# Altium project Service_board.PrjPcb (part 1 of 9)
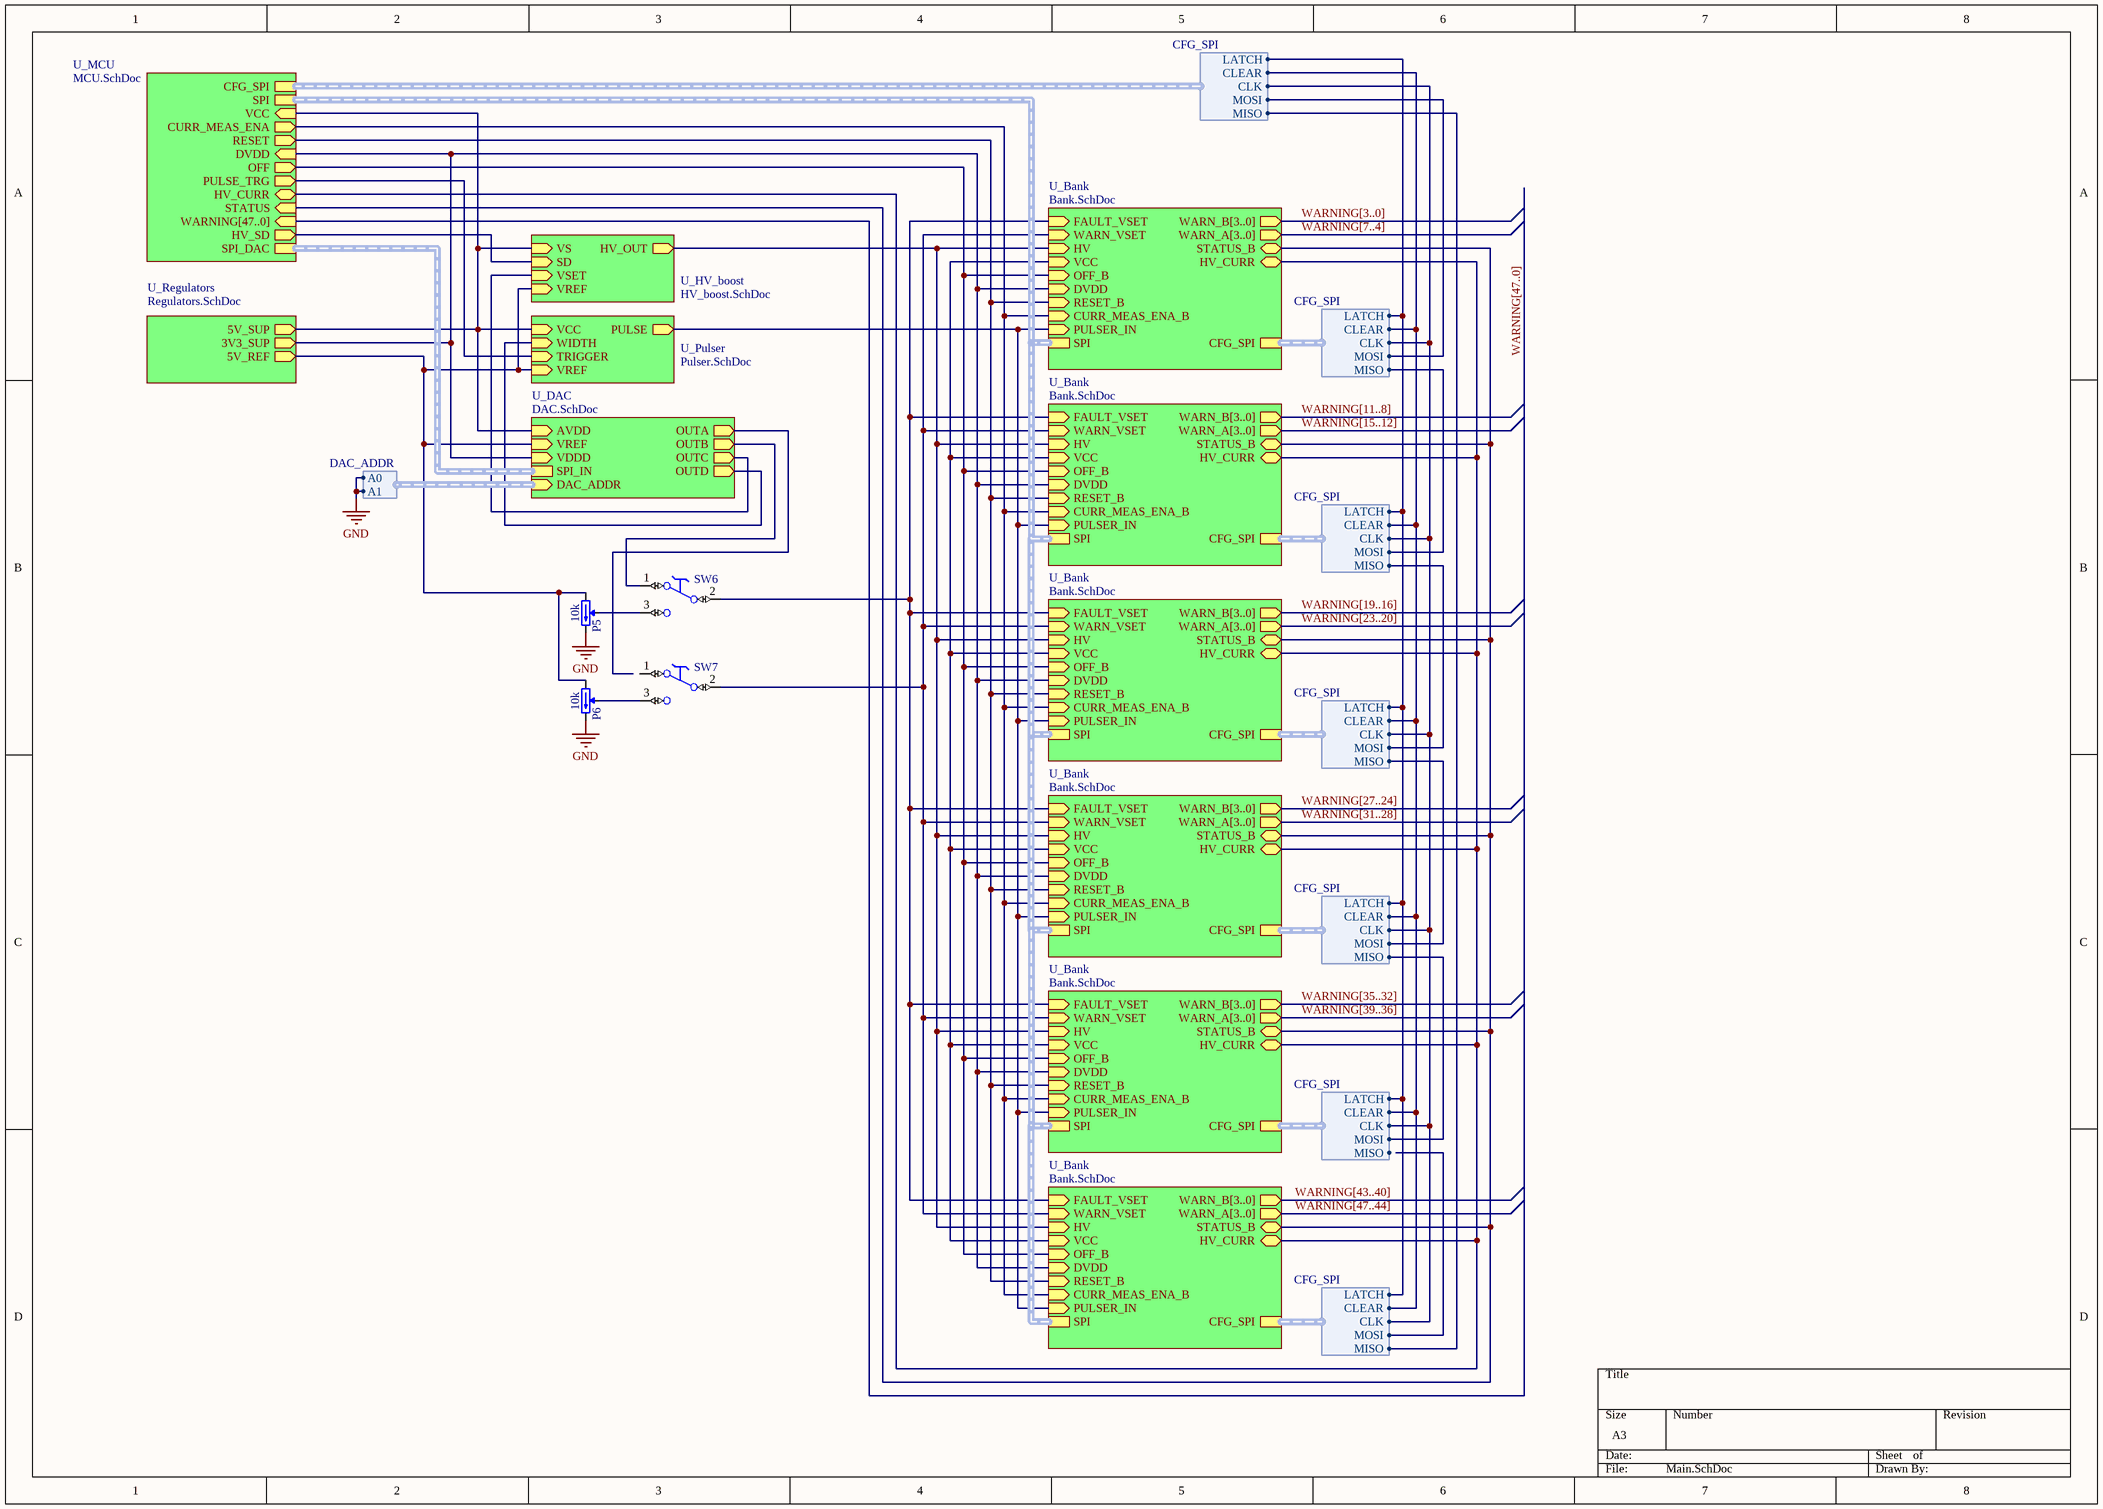
[diagram p0: Main.SchDoc]
10 sheets, 2450 parts. Net scope: hierarchical (ports join the sheet entries above them; power ports are global).
Sheets:
  Main.SchDoc
    U_Pulser = Pulser.SchDoc
    U_HV_boost = HV_boost.SchDoc
    U_MCU = MCU.SchDoc
    U_Bank = Bank.SchDoc
      U_Channel = Channel.SchDoc
        U_TRD = TRD.SchDoc
        U_Switch = Switch.SchDoc
        U_TRD = TRD.SchDoc
        U_Switch = Switch.SchDoc
      U_Channel = Channel.SchDoc
        U_TRD = TRD.SchDoc
        U_Switch = Switch.SchDoc
        U_TRD = TRD.SchDoc
        U_Switch = Switch.SchDoc
      U_Channel = Channel.SchDoc
        U_TRD = TRD.SchDoc
        U_Switch = Switch.SchDoc
        U_TRD = TRD.SchDoc
        U_Switch = Switch.SchDoc
      U_Channel = Channel.SchDoc
        U_TRD = TRD.SchDoc
        U_Switch = Switch.SchDoc
        U_TRD = TRD.SchDoc
        U_Switch = Switch.SchDoc
    U_DAC = DAC.SchDoc
    U_Regulators = Regulators.SchDoc
    U_Bank = Bank.SchDoc
      U_Channel = Channel.SchDoc
        U_TRD = TRD.SchDoc
        U_Switch = Switch.SchDoc
        U_TRD = TRD.SchDoc
        U_Switch = Switch.SchDoc
      U_Channel = Channel.SchDoc
        U_TRD = TRD.SchDoc
        U_Switch = Switch.SchDoc
        U_TRD = TRD.SchDoc
        U_Switch = Switch.SchDoc
      U_Channel = Channel.SchDoc
        U_TRD = TRD.SchDoc
        U_Switch = Switch.SchDoc
        U_TRD = TRD.SchDoc
        U_Switch = Switch.SchDoc
      U_Channel = Channel.SchDoc
        U_TRD = TRD.SchDoc
        U_Switch = Switch.SchDoc
        U_TRD = TRD.SchDoc
        U_Switch = Switch.SchDoc
    U_Bank = Bank.SchDoc
      U_Channel = Channel.SchDoc
        U_TRD = TRD.SchDoc
        U_Switch = Switch.SchDoc
        U_TRD = TRD.SchDoc
        U_Switch = Switch.SchDoc
      U_Channel = Channel.SchDoc
        U_TRD = TRD.SchDoc
        U_Switch = Switch.SchDoc
        U_TRD = TRD.SchDoc
        U_Switch = Switch.SchDoc
      U_Channel = Channel.SchDoc
        U_TRD = TRD.SchDoc
        U_Switch = Switch.SchDoc
        U_TRD = TRD.SchDoc
        U_Switch = Switch.SchDoc
      U_Channel = Channel.SchDoc
        U_TRD = TRD.SchDoc
        U_Switch = Switch.SchDoc
        U_TRD = TRD.SchDoc
        U_Switch = Switch.SchDoc
    U_Bank = Bank.SchDoc
      U_Channel = Channel.SchDoc
        U_TRD = TRD.SchDoc
        U_Switch = Switch.SchDoc
        U_TRD = TRD.SchDoc
        U_Switch = Switch.SchDoc
      U_Channel = Channel.SchDoc
        U_TRD = TRD.SchDoc
        U_Switch = Switch.SchDoc
        U_TRD = TRD.SchDoc
        U_Switch = Switch.SchDoc
      U_Channel = Channel.SchDoc
        U_TRD = TRD.SchDoc
        U_Switch = Switch.SchDoc
        U_TRD = TRD.SchDoc
        U_Switch = Switch.SchDoc
      U_Channel = Channel.SchDoc
        U_TRD = TRD.SchDoc
        U_Switch = Switch.SchDoc
        U_TRD = TRD.SchDoc
        U_Switch = Switch.SchDoc
    U_Bank = Bank.SchDoc
      U_Channel = Channel.SchDoc
        U_TRD = TRD.SchDoc
        U_Switch = Switch.SchDoc
        U_TRD = TRD.SchDoc
        U_Switch = Switch.SchDoc
      U_Channel = Channel.SchDoc
        U_TRD = TRD.SchDoc
        U_Switch = Switch.SchDoc
        U_TRD = TRD.SchDoc
        U_Switch = Switch.SchDoc
      U_Channel = Channel.SchDoc
        U_TRD = TRD.SchDoc
        U_Switch = Switch.SchDoc
        U_TRD = TRD.SchDoc
        U_Switch = Switch.SchDoc
      U_Channel = Channel.SchDoc
        U_TRD = TRD.SchDoc
        U_Switch = Switch.SchDoc
        U_TRD = TRD.SchDoc
        U_Switch = Switch.SchDoc
    U_Bank = Bank.SchDoc
      U_Channel = Channel.SchDoc
        U_TRD = TRD.SchDoc
        U_Switch = Switch.SchDoc
        U_TRD = TRD.SchDoc
        U_Switch = Switch.SchDoc
      U_Channel = Channel.SchDoc
        U_TRD = TRD.SchDoc
        U_Switch = Switch.SchDoc
        U_TRD = TRD.SchDoc
        U_Switch = Switch.SchDoc
      U_Channel = Channel.SchDoc
        U_TRD = TRD.SchDoc
        U_Switch = Switch.SchDoc
        U_TRD = TRD.SchDoc
        U_Switch = Switch.SchDoc
      U_Channel = Channel.SchDoc
        U_TRD = TRD.SchDoc
        U_Switch = Switch.SchDoc
        U_TRD = TRD.SchDoc
        U_Switch = Switch.SchDoc

## Sheet Main.SchDoc
size A3; DocumentNumber: 1; SheetNumber: 1; SheetTotal: 10

### Parts
P5  10k  [TRIM_BOURNS_3266W]
P6  10k  [TRIM_BOURNS_3266W]
SW6  Switch  [SW_TYCO_1-1437575-4]  (value not drawn)
SW7  Switch  [SW_TYCO_1-1437575-4]  (value not drawn)

### Sub-sheets
U_Bank = Bank.SchDoc: FAULT_VSET (in), WARN_VSET (in), HV (in), VCC (in), OFF_B (in), DVDD (in), RESET_B (in), CURR_MEAS_ENA_B (in), PULSER_IN (in), SPI (harness SPI), CFG_SPI (harness CFG_SPI), WARN_B[3..0] (out), WARN_A[3..0] (out), STATUS_B (bidir), HV_CURR (bidir)
U_Bank = Bank.SchDoc: FAULT_VSET (in), WARN_VSET (in), HV (in), VCC (in), OFF_B (in), DVDD (in), RESET_B (in), CURR_MEAS_ENA_B (in), PULSER_IN (in), SPI (harness SPI), CFG_SPI (harness CFG_SPI), WARN_B[3..0] (out), WARN_A[3..0] (out), STATUS_B (bidir), HV_CURR (bidir)
U_Bank = Bank.SchDoc: FAULT_VSET (in), WARN_VSET (in), HV (in), VCC (in), OFF_B (in), DVDD (in), RESET_B (in), CURR_MEAS_ENA_B (in), PULSER_IN (in), SPI (harness SPI), CFG_SPI (harness CFG_SPI), WARN_B[3..0] (out), WARN_A[3..0] (out), STATUS_B (bidir), HV_CURR (bidir)
U_Bank = Bank.SchDoc: FAULT_VSET (in), WARN_VSET (in), HV (in), VCC (in), OFF_B (in), DVDD (in), RESET_B (in), CURR_MEAS_ENA_B (in), PULSER_IN (in), SPI (harness SPI), CFG_SPI (harness CFG_SPI), WARN_B[3..0] (out), WARN_A[3..0] (out), STATUS_B (bidir), HV_CURR (bidir)
U_Bank = Bank.SchDoc: FAULT_VSET (in), WARN_VSET (in), HV (in), VCC (in), OFF_B (in), DVDD (in), RESET_B (in), CURR_MEAS_ENA_B (in), PULSER_IN (in), SPI (harness SPI), CFG_SPI (harness CFG_SPI), WARN_B[3..0] (out), WARN_A[3..0] (out), STATUS_B (bidir), HV_CURR (bidir)
U_Bank = Bank.SchDoc: FAULT_VSET (in), WARN_VSET (in), HV (in), VCC (in), OFF_B (in), DVDD (in), RESET_B (in), CURR_MEAS_ENA_B (in), PULSER_IN (in), SPI (harness SPI), CFG_SPI (harness CFG_SPI), WARN_B[3..0] (out), WARN_A[3..0] (out), STATUS_B (bidir), HV_CURR (bidir)
U_DAC = DAC.SchDoc: AVDD (in), VREF (in), VDDD (in), SPI_IN (harness SPI_DAC), DAC_ADDR (in, harness DAC_ADDR), OUTA (out), OUTB (out), OUTC (out), OUTD (out)
U_HV_boost = HV_boost.SchDoc: VS (in), HV_OUT (out), SD (in), VSET (in), VREF (in)
U_MCU = MCU.SchDoc: STATUS (in), OFF (out), RESET (out), CURR_MEAS_ENA (out), SPI (harness SPI), CFG_SPI (harness CFG_SPI), WARNING[47..0] (in), DVDD (in), VCC (in), HV_CURR (bidir), PULSE_TRG (out), HV_SD (out), SPI_DAC (harness SPI_DAC)
U_Pulser = Pulser.SchDoc: VCC (in), WIDTH (in), TRIGGER (in), PULSE (out), VREF (in)
U_Regulators = Regulators.SchDoc: 5V_SUP (out), 3V3_SUP (out), 5V_REF (out)

### Harnesses
DAC_ADDR: A0, A1
CFG_SPI: LATCH, CLEAR, CLK, MOSI, MISO

### Nets
DVDD: sheet U_MCU/DVDD, sheet U_Bank/DVDD, sheet U_DAC/VDDD, sheet U_Regulators/3V3_SUP, sheet U_Bank/DVDD, sheet U_Bank/DVDD, sheet U_Bank/DVDD, sheet U_Bank/DVDD, sheet U_Bank/DVDD
GND: P5.3(CW) P6.3(CW) ; sheet U_DAC/DAC_ADDR.A0, sheet U_DAC/DAC_ADDR.A1
OUTB: SW6.1(NC) ; sheet U_DAC/OUTB
OUTC: sheet U_HV_boost/VSET, sheet U_DAC/OUTC
OUTD: sheet U_Pulser/WIDTH, sheet U_DAC/OUTD
Net=_Name_+_'_'_+_Manufacturer1_10: sheet U_Pulser/VCC, sheet U_HV_boost/VS, sheet U_MCU/VCC, sheet U_DAC/AVDD, sheet U_Regulators/5V_SUP
NetC41_U_Bank_U_Channel_U_Switch#1_1: sheet U_Bank/VCC, sheet U_Bank/VCC, sheet U_Bank/VCC, sheet U_Bank/VCC, sheet U_Bank/VCC, sheet U_Bank/VCC
NetC?#3_2: sheet U_HV_boost/HV_OUT, sheet U_Bank/HV, sheet U_Bank/HV, sheet U_Bank/HV, sheet U_Bank/HV, sheet U_Bank/HV, sheet U_Bank/HV
NetIC1_U_Bank#1_9: sheet U_Bank/CFG_SPI.MISO, sheet U_Bank/CFG_SPI.MOSI
NetIC1_U_Bank#1_10: sheet U_Bank/CFG_SPI.CLEAR, sheet U_MCU/CFG_SPI.CLEAR
NetIC1_U_Bank#1_11: sheet U_Bank/CFG_SPI.CLK, sheet U_MCU/CFG_SPI.CLK
NetIC1_U_Bank#1_12: sheet U_Bank/CFG_SPI.LATCH, sheet U_MCU/CFG_SPI.LATCH
NetIC1_U_Bank#1_14: sheet U_Bank/CFG_SPI.MOSI, sheet U_MCU/CFG_SPI.MOSI
NetIC1_U_Bank#2_9: sheet U_Bank/CFG_SPI.MISO, sheet U_Bank/CFG_SPI.MOSI
NetIC1_U_Bank#3_9: sheet U_Bank/CFG_SPI.MISO, sheet U_Bank/CFG_SPI.MOSI
NetIC1_U_Bank#4_9: sheet U_Bank/CFG_SPI.MISO, sheet U_Bank/CFG_SPI.MOSI
NetIC1_U_Bank#6_9: sheet U_Bank/CFG_SPI.MISO, sheet U_MCU/CFG_SPI.MISO
NetIC2_U_Bank_U_Channel#1_2: sheet U_MCU/OFF, sheet U_Bank/OFF_B, sheet U_Bank/OFF_B, sheet U_Bank/OFF_B, sheet U_Bank/OFF_B, sheet U_Bank/OFF_B, sheet U_Bank/OFF_B
NetIC2_U_Bank_U_Channel#1_4: sheet U_MCU/RESET, sheet U_Bank/RESET_B, sheet U_Bank/RESET_B, sheet U_Bank/RESET_B, sheet U_Bank/RESET_B, sheet U_Bank/RESET_B, sheet U_Bank/RESET_B
NetIC2_U_Bank_U_Channel#1_6: sheet U_MCU/CURR_MEAS_ENA, sheet U_Bank/CURR_MEAS_ENA_B, sheet U_Bank/CURR_MEAS_ENA_B, sheet U_Bank/CURR_MEAS_ENA_B, sheet U_Bank/CURR_MEAS_ENA_B, sheet U_Bank/CURR_MEAS_ENA_B, sheet U_Bank/CURR_MEAS_ENA_B
NetIC8_23: sheet U_MCU/HV_CURR, sheet U_Bank/HV_CURR, sheet U_Bank/HV_CURR, sheet U_Bank/HV_CURR, sheet U_Bank/HV_CURR, sheet U_Bank/HV_CURR, sheet U_Bank/HV_CURR
NetIC8_56: sheet U_MCU/STATUS, sheet U_Bank/STATUS_B, sheet U_Bank/STATUS_B, sheet U_Bank/STATUS_B, sheet U_Bank/STATUS_B, sheet U_Bank/STATUS_B, sheet U_Bank/STATUS_B
NetIC8_61: sheet U_HV_boost/SD, sheet U_MCU/HV_SD
NetIC8_62: sheet U_Pulser/TRIGGER, sheet U_MCU/PULSE_TRG
NetIC11_5: sheet U_Pulser/PULSE, sheet U_Bank/PULSER_IN, sheet U_Bank/PULSER_IN, sheet U_Bank/PULSER_IN, sheet U_Bank/PULSER_IN, sheet U_Bank/PULSER_IN, sheet U_Bank/PULSER_IN
NetL6_2: P5.1(CCW) P6.1(CCW) ; sheet U_Pulser/VREF, sheet U_HV_boost/VREF, sheet U_DAC/VREF, sheet U_Regulators/5V_REF
NetP5_2: P5.2(W) SW6.3(NO)
NetP6_2: P6.2(W) SW7.3(NO)
NetR37_U_Bank_U_Channel_U_Switch#1_1: SW6.2(C) ; sheet U_Bank/FAULT_VSET, sheet U_Bank/FAULT_VSET, sheet U_Bank/FAULT_VSET, sheet U_Bank/FAULT_VSET, sheet U_Bank/FAULT_VSET, sheet U_Bank/FAULT_VSET
NetR?_U_Bank_U_Channel_U_Switch#3_1: SW7.2(C) ; sheet U_Bank/WARN_VSET, sheet U_Bank/WARN_VSET, sheet U_Bank/WARN_VSET, sheet U_Bank/WARN_VSET, sheet U_Bank/WARN_VSET, sheet U_Bank/WARN_VSET

Not connected (* = marked no-connect by the designer): SW7 1(NC)

### Buses and harness runs
bus WARNING[3..0] = sheet U_Bank/WARN_B[3..0]
bus WARNING[7..4] = sheet U_Bank/WARN_A[3..0]
bus WARNING[11..8] = sheet U_Bank/WARN_B[3..0]
bus WARNING[15..12] = sheet U_Bank/WARN_A[3..0]
bus WARNING[19..16] = sheet U_Bank/WARN_B[3..0]
bus WARNING[23..20] = sheet U_Bank/WARN_A[3..0]
bus WARNING[27..24] = sheet U_Bank/WARN_B[3..0]
bus WARNING[31..28] = sheet U_Bank/WARN_A[3..0]
bus WARNING[35..32] = sheet U_Bank/WARN_B[3..0]
bus WARNING[39..36] = sheet U_Bank/WARN_A[3..0]
bus WARNING[43..40] = sheet U_Bank/WARN_B[3..0]
bus WARNING[47..0] = sheet U_MCU/WARNING[47..0]
bus WARNING[47..44] = sheet U_Bank/WARN_A[3..0]
harness sheet U_Bank/SPI = sheet U_MCU/SPI
harness sheet U_DAC/SPI_IN = sheet U_MCU/SPI_DAC

### Library data of the parts
P5 P6 = TRIM_12T_10K_BOURNS_3266W-1-103LF: Trimming Potentiometer; Part Description: 12 Turn Trimming Potentiometer (Top Adjustement); Manufacturer: BOURNS; Power: 0.25W; TC: ±100ppm/°C; Tolerance: ±10%; PressFit: No; Part Number: TRIM_12T_10K_BOURNS_3266W-1-103LF; Component Kind: Standard; Component Type: Standard; Pin Count: 3; Value: 10k; Manufacturer Part Number: 3266W-1-103LF; Case: 3266W; Mounted: Yes; Socket: No; SMD: No; Sense: No; ComponentHeight: 7.75mm; HelpURL: \\cern.ch\dfs\Applications\Altium\Datasheets\TRIM_BOURNS_3266W.pdf; Author: CERN DEM JLC; CreateDate: 10.06.2008; LatestRevisionDate: 28.11.2012
SW6 SW7 = SW_TYCO_1-1437575-4: SPDT Switch; Part Description: 30VDC, 100mA, Slide Low Profile SPDT Switch, SSA Series; Manufacturer: TYCO; Manufacturer Part Number: 1-1437575-4 or SSA-12; PressFit: No; Part Number: SW_TYCO_1-1437575-4; Component Kind: Standard; Component Type: Standard; Pin Count: 3; PackageDescription: Body 8.79 x 3.4mm, Slide Low Profile SPDT Switch, SSA Series; Family: Switch; Mounted: Yes; Socket: No; SMD: No; Sense: No; Status: None; ComponentHeight: 5.4mm; HelpURL: \\cern.ch\dfs\Applications\Altium\Datasheets\SW_TYCO_1-1437575-4.pdf; Author: CERN DEM JLC; CreateDate: 11.11.2013; LatestRevisionDate: 11.11.2013

## Sheet Pulser.SchDoc
size A4; DocumentNumber: 6; SheetNumber: 6; SheetTotal: 10
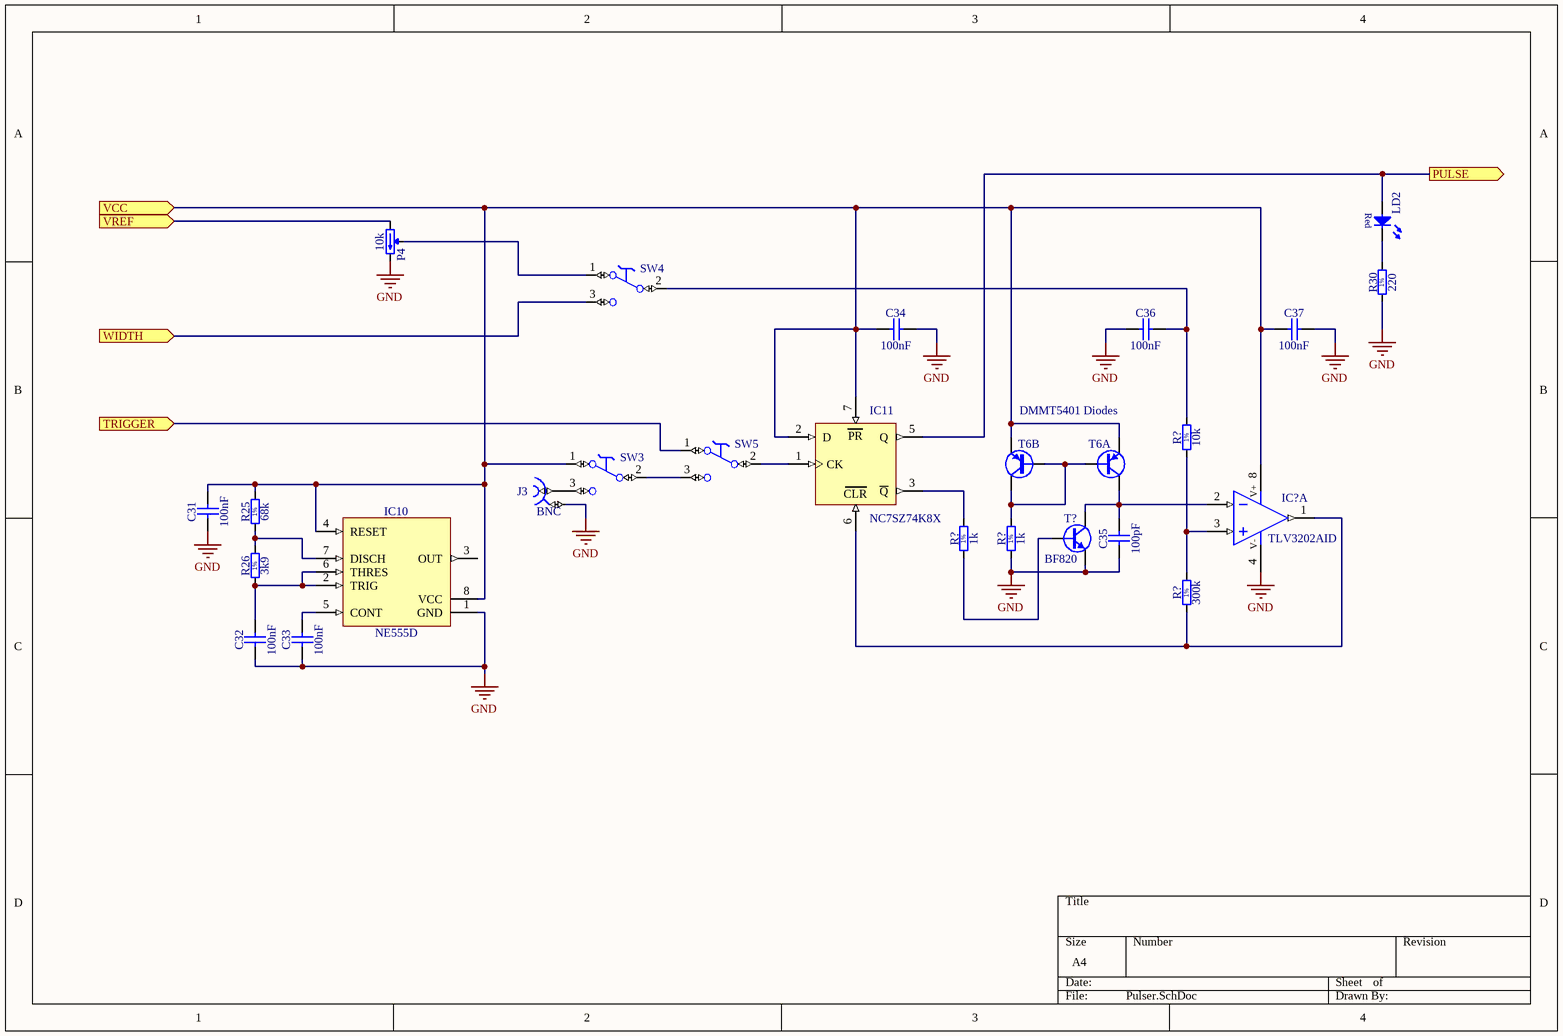
[diagram p1: Pulser.SchDoc]

### Parts
(Parts that share a designator on the sheet are numbered #1, #2 ... from top to bottom, then left to right.)
C31  100nF  [CAPC2012X135N]
C32  100nF  [CAPC2012X135N]
C33  100nF  [CAPC2012X135N]
C34  100nF  [CAPC2012X135N]
C35  100pF  [CAPC3216X140N]
C36  100nF  [CAPC2012X135N]
C37  100nF  [CAPC2012X135N]
IC10  NE555D  [SOIC127P600X175-8N]
IC11  NC7SZ74K8X  [SOP50P310X90-8N]
IC?#1  TLV3202AID  [SOIC127P600X175-8N]  (part A of 2)
J3  BNC  [AMPHENOL_31-5329]
LD2  Super Red  [LED_OSRAM_LSR976]  (value not drawn)
P4  10k  [TRIM_BOURNS_3266W]
R25  68k  [RESC2012X60N]
R26  3k9  [RESC2012X60N]
R30  220  [RESC2012X60N]
R?#1  10k  [RESC2012X60N]
R?#2  1k  [RESC2012X60N]
R?#3  1k  [RESC2012X60N]
R?#4  300k  [RESC2012X60N]
SW3  Switch  [SW_TYCO_1-1437575-4]  (value not drawn)
SW4  Switch  [SW_TYCO_1-1437575-4]  (value not drawn)
SW5  Switch  [SW_TYCO_1-1437575-4]  (value not drawn)
T6  DMMT5401 Diodes  [SOT95P280X145-6N]  (parts A,B of 2)
T?#1  BF820  [SOT95P230X110-3N]

### Ports
PULSE (out), TRIGGER (in), VCC (in), VREF (in), WIDTH (in)

### Nets
GND: C31.1 C32.1 C33.1 C34.2 C35.1 C36.1 C37.2 IC10.1(GND) IC?#1.4(V-) J3.2 P4.3(CW) R30.1 R?#3.1 T?#1.2(E)
OUTD: SW4.3(NO) ; port WIDTH
Net=_Name_+_'_'_+_Manufacturer1_10: C31.2 C34.1 C37.1 IC10.4(RESET) IC10.8(VCC) IC11.2(D) IC11.7(~{PR}) IC?#1.8(V+) R25.2 SW3.1(NC) T6.5(E) T6.6(E) ; port VCC
NetC32_2: C32.2 IC10.2(TRIG) IC10.6(THRES) R26.1
NetC33_2: C33.2 IC10.5(CONT)
NetC35_2: C35.2 IC?#1.2(IN-) T6.1(C) T?#1.3(C)
NetC36_2: C36.2 R?#1.2 SW4.2(C)
NetIC8_62: SW5.1(NC) ; port TRIGGER
NetIC10_7: IC10.7(DISCH) R25.1 R26.2
NetIC11_1: IC11.1(CK) SW5.2(C)
NetIC11_3: IC11.3(~{Q}) R?#2.2
NetIC11_5: IC11.5(Q) LD2.2(A) ; port PULSE
NetIC11_6: IC11.6(~{CLR}) IC?#1.1(OUT) R?#4.1
NetIC?#1_3: IC?#1.3(IN+) R?#1.1 R?#4.2
NetJ3_1: J3.1 SW3.3(NO)
NetL6_2: P4.1(CCW) ; port VREF
NetLD2_1: LD2.1(C) R30.2
NetP4_2: P4.2(W) SW4.1(NC)
NetR?#2_1: R?#2.1 T?#1.1(B)
NetR?#3_2: R?#3.2 T6.2(B) T6.3(B) T6.4(C)
NetSW3_2: SW3.2(C) SW5.3(NO)

Not connected (* = marked no-connect by the designer): IC10 3(OUT); IC11 4(GND) 8(VCC)

### Notes on the sheet
- (in symbol LED_OSRAM_LSR976) Red
- (in symbol NC7SZ74K8X) PR; CLR
- (in symbol R0805_1K_1%_0.33W_100PPM_VISHAY_CRCW-HP) 1%
- (in symbol R0805_3K9_1%_0.125W_100PPM) 1%
- (in symbol R0805_10K_1%_0.125W_100PPM) 1%
- (in symbol R0805_68K_1%_0.125W_100PPM) 1%
- (in symbol R0805_220R_1%_0.125W_100PPM) 1%
- (in symbol R0805_300K_1%_0.125W_100PPM) 1%

### Library data of the parts
C31-C34 C36 C37 = CC0805_100NF_50V_10%_X7R: Non-polarised capacitor; Part Description: SMD Multilayer Chip Ceramic Capacitor; Manufacturer: GENERIC; Manufacturer1 Part Number: C2012X7R1H104K085AA; Voltage: 50V; TC: X7R; Tolerance: ±10%; Part Number: CC0805_100NF_50V_10%_X7R; Component Kind: Standard; Component Type: Standard; Pin Count: 2; Value: 100nF; Status: Preferred; Manufacturer Part Number: CC0805_100NF_50V_10%_X7R; Case: 0805; Mounted: Yes; Socket: No; SMD: Yes; Sense: No; Manufacturer1 Example: TDK; Manufacturer1 ComponentHeight: 1mm; HelpURL: \\cern.ch\dfs\Applications\Altium\Datasheets\CC0805_X7R_TDK_C.pdf; Author: CERN DEM JLC; CreateDate: 03.12.2007; LatestRevisionDate: 22.04.2015
C35 = CC1206_100PF_50V_5%_NP0: Non-polarised capacitor; Part Description: SMD Multilayer Chip Ceramic Capacitor; Manufacturer: GENERIC; Manufacturer1 Part Number: VJ1206A101JXAAT; Voltage: 50V; TC: C0G/NP0; Tolerance: ±5%; Part Number: CC1206_100PF_50V_5%_NP0; Component Kind: Standard; Component Type: Standard; Pin Count: 2; Value: 100pF; Status: Preferred; Manufacturer Part Number: CC1206_100PF_50V_5%_NP0; Case: 1206; Mounted: Yes; Socket: No; SMD: Yes; Sense: No; Manufacturer1 Example: VISHAY VITRAMON; Manufacturer1 ComponentHeight: 1.7mm; HelpURL: \\cern.ch\dfs\Applications\Altium\Datasheets\CC1206_NP0_VISHAY_VJ.pdf; Author: CERN DEM JLC; CreateDate: 03.12.2007; LatestRevisionDate: 03.12.2007
IC10 = NE555D: Precision Timer; Manufacturer: TEXAS INSTRUMENTS; PressFit: No; Bonding: No; Part Number: NE555D; Component Kind: Standard; Component Type: Standard; Device: NE555D; PackageDescription: SOIC 8, Pitch 1.27mm, Body 4x5mm, IPC Medium Density; Part Description: Precision Timer; Manufacturer Part Number: NE555D; Pin Count: 8; Case: SOIC8; Mounted: Yes; Socket: No; SMD: Yes; Sense: No; ComponentHeight: 1.75mm; Author: CERN DEM JMW; HelpURL: \\cern.ch\dfs\Applications\Altium\Datasheets\NE555D.pdf; CreateDate: 16.04.2009; LatestRevisionDate: 16.04.2009
IC11 = NC7SZ74K8X: TinyLogic® UHS D-Type Flip-Flop With Preset And Clear; Manufacturer: FAIRCHILD SEMICONDUCTOR; PressFit: No; Bonding: No; Part Number: NC7SZ74K8X; Component Kind: Standard; Component Type: Standard; Device: NC7SZ74K8X; PackageDescription: SOP, 0.50mm pitch; 8 pin, 2.30mm W X 2.00mm L X 0.90mm H body, PC Medium Density; Part Description: TinyLogic® UHS D-Type Flip-Flop With Preset And Clear; Manufacturer Part Number: NC7SZ74K8X; Pin Count: 6; Case: TSSOP8; Mounted: Yes; Socket: No; SMD: Yes; Sense: No; ComponentHeight: 0.9mm; Author: CERN DEM JLC; HelpURL: \\cern.ch\dfs\Applications\Altium\Datasheets\NC7SZ74K8X.pdf; CreateDate: 31.08.2011; LatestRevisionDate: 31.08.2011
IC?#1 = TLV3202AID: Dual Operational Amplifier; Part Description: Dual 40-ns, microPOWER, Push-Pull Output Comparator; Manufacturer: TEXAS INSTRUMENTS; PressFit: No; Bonding: No; Part Number: TLV3202AID; Component Kind: Standard; Component Type: Standard; Device: TLV3202AID; PackageDescription: SOIC 8, Pitch 1.27mm - Body 4x5mm, IPC Medium Density; Manufacturer Part Number: TLV3202AID; Pin Count: 8; Case: SOIC8; Mounted: Yes; Socket: No; SMD: Yes; Sense: No; ComponentHeight: 1.75mm; Author: CERN DEM JLC; HelpURL: \\cern.ch\dfs\Applications\Altium\Datasheets\TLV3202AID.pdf; CreateDate: 11.02.2015; LatestRevisionDate: 11.02.2015
J3 = AMPHENOL_31-5329: Part Description: 50 Ohms BNC PCB Receptacle (Jack), Post Terminal, 3 Legs; Manufacturer: AMPHENOL-RF; PressFit: No; Part Number: AMPHENOL_31-5329; Component Kind: Standard; Component Type: Standard; Pin Count: 2; Family: BNC; Mounted: Yes; Socket: No; SMD: No; Sense: No; Status: None; Manufacturer Part Number: 31-5329; ComponentHeight: 17.6mm; HelpURL: \\cern.ch\dfs\Applications\Altium\Datasheets\AMPHENOL_31-5329.pdf; Author: CERN DEM JLC; CreateDate: 03.06.2009; LatestRevisionDate: 14.07.2011
LD2 = LED_OSRAM_LSR976: LED Red 1C 2A; Part Description: Surface Mount Super Red LED (0805 Case); Manufacturer: OSRAM; Manufacturer Part Number: LSR976; PressFit: No; Bonding: No; Part Number: LED_OSRAM_LSR976; Component Kind: Standard; Component Type: Standard; Color: Super Red; PackageDescription: Super Red Chip LED, 2-Leads, Body 2 x1.25mm, IPC Medium Density; Pin Count: 2; Case: 0805; Mounted: Yes; Socket: No; SMD: Yes; Sense: No; ComponentHeight: 0.9mm; HelpURL: \\cern.ch\dfs\Applications\Altium\Datasheets\LED_OSRAM_LSR976.pdf; Author: CERN DEM JLC; CreateDate: 18.05.2010; LatestRevisionDate: 18.05.2010
P4 = TRIM_12T_10K_BOURNS_3266W-1-103LF: as P5 on sheet Main; Part Number: TRIM_12T_10K_BOURNS_3266W-1-103LF; Component Kind: Standard; Component Type: Standard; Pin Count: 3; Value: 10k; Manufacturer Part Number: 3266W-1-103LF; Case: 3266W; Mounted: Yes; Socket: No; SMD: No; Sense: No; ComponentHeight: 7.75mm; HelpURL: \\cern.ch\dfs\Applications\Altium\Datasheets\TRIM_BOURNS_3266W.pdf; Author: CERN DEM JLC; CreateDate: 10.06.2008; LatestRevisionDate: 28.11.2012
R25 = R0805_68K_1%_0.125W_100PPM: Resistor - 1%; Part Description: General Purpose Thick Film Chip Resistor; Manufacturer: GENERIC; Manufacturer1 Part Number: NRC10F6802TRF; Power: 0.125W; TC: ±100ppm/°C; PressFit: No; Part Number: R0805_68K_1%_0.125W_100PPM; Component Kind: Standard; Component Type: Standard; Pin Count: 2; Value: 68k; Status: Preferred; Tolerance: ±1%; Manufacturer Part Number: R0805_68K_1%_0.125W_100PPM; Case: 0805; Mounted: Yes; Sense: No; Socket: No; SMD: Yes; Manufacturer1 Example: NIC COMPONENT; Manufacturer1 ComponentHeight: 0.6mm; HelpURL: \\cern.ch\dfs\Applications\Altium\Datasheets\R0805_NIC_NRC.pdf; Author: CERN DEM JLC; CreateDate: 03.12.2007; LatestRevisionDate: 13.03.2008
R26 = R0805_3K9_1%_0.125W_100PPM: Resistor - 1%; Part Description: General Purpose Thick Film Chip Resistor; Manufacturer: GENERIC; Manufacturer1 Part Number: NRC10F3901TRF; Power: 0.125W; TC: ±100ppm/°C; PressFit: No; Part Number: R0805_3K9_1%_0.125W_100PPM; Component Kind: Standard; Component Type: Standard; Pin Count: 2; Value: 3k9; Status: Preferred; Tolerance: ±1%; Manufacturer Part Number: R0805_3K9_1%_0.125W_100PPM; Case: 0805; Mounted: Yes; Sense: No; Socket: No; SMD: Yes; Manufacturer1 Example: NIC COMPONENT; Manufacturer1 ComponentHeight: 0.6mm; HelpURL: \\cern.ch\dfs\Applications\Altium\Datasheets\R0805_NIC_NRC.pdf; Author: CERN DEM JLC; CreateDate: 03.12.2007; LatestRevisionDate: 13.03.2008
R30 = R0805_220R_1%_0.125W_100PPM: Resistor - 1%; Part Description: General Purpose Thick Film Chip Resistor; Manufacturer: GENERIC; Manufacturer1 Part Number: NRC10F2200TRF; Power: 0.125W; TC: ±100ppm/°C; PressFit: No; Part Number: R0805_220R_1%_0.125W_100PPM; Component Kind: Standard; Component Type: Standard; Pin Count: 2; Value: 220; Status: Preferred; Tolerance: ±1%; Manufacturer Part Number: R0805_220R_1%_0.125W_100PPM; Case: 0805; Mounted: Yes; Sense: No; Socket: No; SMD: Yes; Manufacturer1 Example: NIC COMPONENT; Manufacturer1 ComponentHeight: 0.6mm; HelpURL: \\cern.ch\dfs\Applications\Altium\Datasheets\R0805_NIC_NRC.pdf; Author: CERN DEM JLC; CreateDate: 03.12.2007; LatestRevisionDate: 13.03.2008
R?#1 = R0805_10K_1%_0.125W_100PPM: Resistor - 1%; Part Description: General Purpose Thick Film Chip Resistor; Manufacturer: GENERIC; Manufacturer1 Part Number: NRC10F1002TRF; Power: 0.125W; TC: ±100ppm/°C; PressFit: No; Part Number: R0805_10K_1%_0.125W_100PPM; Component Kind: Standard; Component Type: Standard; Pin Count: 2; Value: 10k; Status: Preferred; Tolerance: ±1%; Manufacturer Part Number: R0805_10K_1%_0.125W_100PPM; Case: 0805; Mounted: Yes; Sense: No; Socket: No; SMD: Yes; Manufacturer1 Example: NIC COMPONENT; Manufacturer1 ComponentHeight: 0.6mm; HelpURL: \\cern.ch\dfs\Applications\Altium\Datasheets\R0805_NIC_NRC.pdf; Author: CERN DEM JLC; CreateDate: 03.12.2007; LatestRevisionDate: 13.03.2008
R?#2 R?#3 = R0805_1K_1%_0.33W_100PPM_VISHAY_CRCW-HP: Resistor - 1%; Part Description: 150V, Pulse Proof, High Power Thick Film Chip Resistor; Manufacturer: VISHAY DRALORIC; Manufacturer Part Number: CRCW08051K00FKEAHP; Power: 0.33W; TC: ±100ppm/°C; PressFit: No; Part Number: R0805_1K_1%_0.33W_100PPM_VISHAY_CRCW-HP; Component Kind: Standard; Component Type: Standard; Pin Count: 2; Value: 1k; Status: None; Tolerance: ±1%; Case: 0805; Mounted: Yes; Sense: No; Socket: No; SMD: Yes; Manufacturer1 ComponentHeight: 0.6mm; HelpURL: \\cern.ch\dfs\Applications\Altium\Datasheets\R0805_VISHAY_CRCW-HP e3.pdf; Author: CERN DEM JLC; CreateDate: 16.06.2010; LatestRevisionDate: 16.06.2010
R?#4 = R0805_300K_1%_0.125W_100PPM: Resistor - 1%; Part Description: General Purpose Thick Film Chip Resistor; Manufacturer: GENERIC; Manufacturer1 Part Number: NRC10F3003TRF; Power: 0.125W; TC: ±100ppm/°C; PressFit: No; Part Number: R0805_300K_1%_0.125W_100PPM; Component Kind: Standard; Component Type: Standard; Pin Count: 2; Value: 300k; Status: Preferred; Tolerance: ±1%; Manufacturer Part Number: R0805_300K_1%_0.125W_100PPM; Case: 0805; Mounted: Yes; Sense: No; Socket: No; SMD: Yes; Manufacturer1 Example: NIC COMPONENT; Manufacturer1 ComponentHeight: 0.6mm; HelpURL: \\cern.ch\dfs\Applications\Altium\Datasheets\R0805_NIC_NRC.pdf; Author: CERN DEM JLC; CreateDate: 03.12.2007; LatestRevisionDate: 13.03.2008
SW3-SW5 = SW_TYCO_1-1437575-4: as SW6 on sheet Main; Part Number: SW_TYCO_1-1437575-4; Component Kind: Standard; Component Type: Standard; Pin Count: 3; PackageDescription: Body 8.79 x 3.4mm, Slide Low Profile SPDT Switch, SSA Series; Family: Switch; Mounted: Yes; Socket: No; SMD: No; Sense: No; Status: None; ComponentHeight: 5.4mm; HelpURL: \\cern.ch\dfs\Applications\Altium\Datasheets\SW_TYCO_1-1437575-4.pdf; Author: CERN DEM JLC; CreateDate: 11.11.2013; LatestRevisionDate: 11.11.2013
T6 = DMMT5401: Name: DMMT5401; Manufacturer: Diodes
T?#1 = BF820: NPN Transistor; Part Description: 300V 50mA NPN High-Voltage Transistor; Manufacturer: NXP SEMICONDUCTORS; PressFit: No; Bonding: No; Part Number: BF820; Component Kind: Standard; Component Type: Standard; Device: BF820; PackageDescription: SOT23, 3 pin, Pitch 0.95mm - 1.3mm W X 2.9mm L X 1.1mm H, IPC Medium Density; Manufacturer Part Number: BF820; Pin Count: 3; Case: SOT23-3; Mounted: Yes; Socket: No; SMD: Yes; Sense: No; ComponentHeight: 1.1mm; HelpURL: \\cern.ch\dfs\Applications\Altium\Datasheets\BF820.pdf; Author: CERN DEM JLC; CreateDate: 23.09.2014; LatestRevisionDate: 23.09.2014

## Sheet HV_boost.SchDoc
size A4; DocumentNumber: 4; SheetNumber: 4; SheetTotal: 10
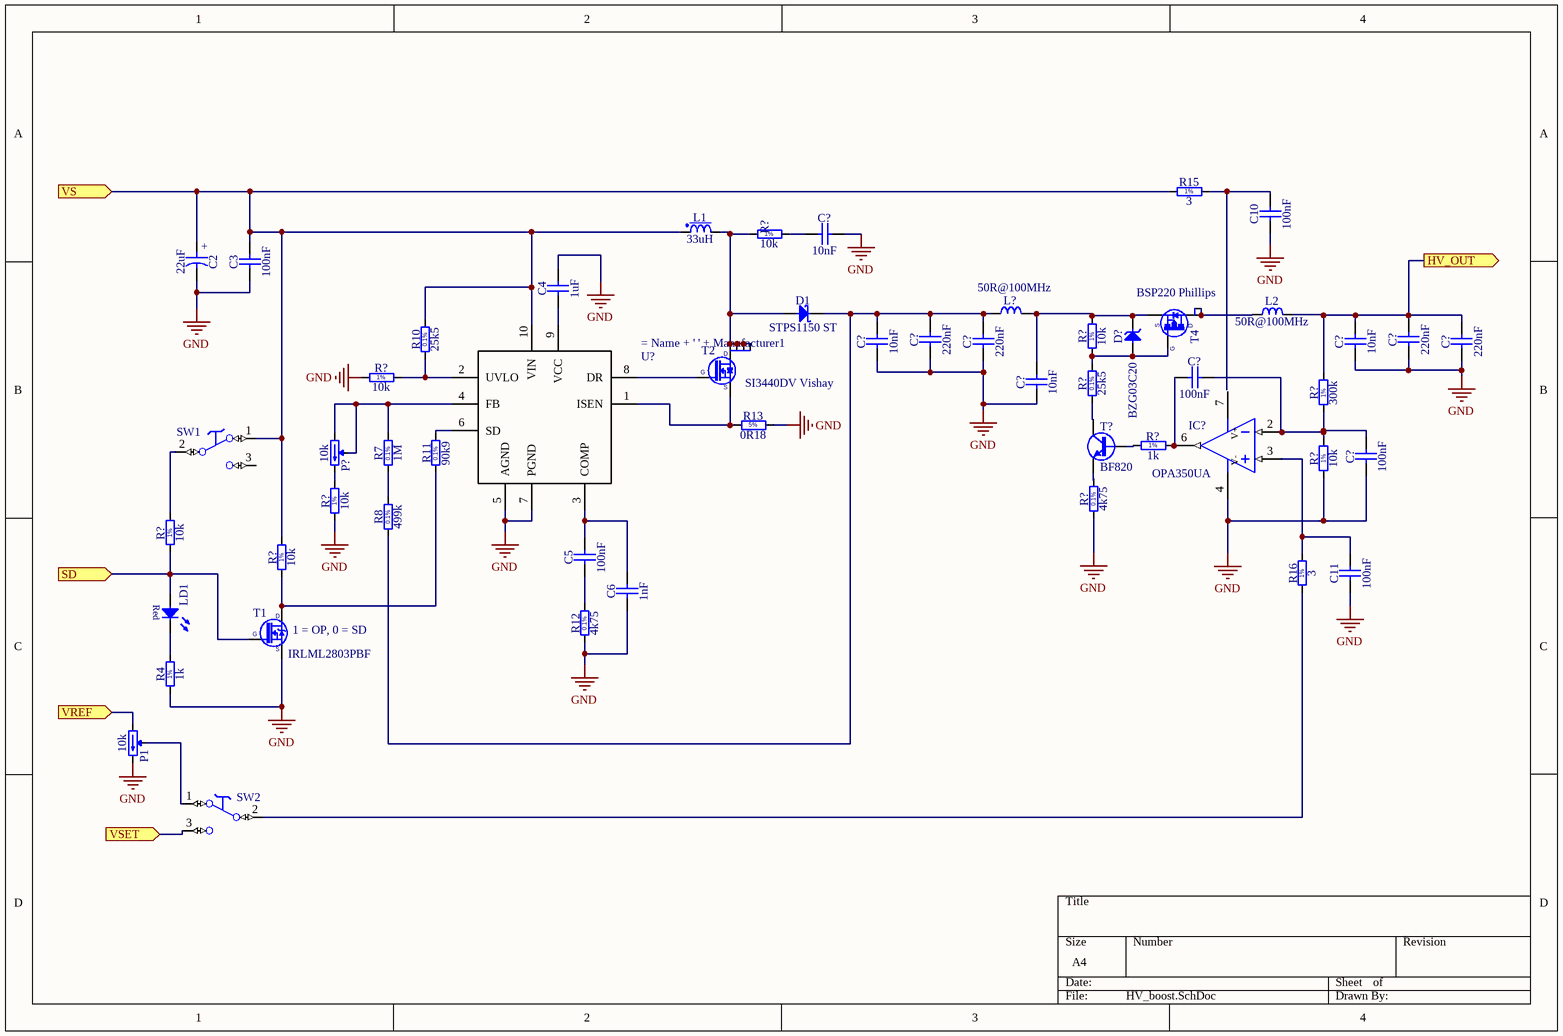
[diagram p2: HV_boost.SchDoc]

### Parts
(Parts that share a designator on the sheet are numbered #1, #2 ... from top to bottom, then left to right.)
=_Name_+_'_'_+_Manufacturer1  U?  [SOP50P490X110-10N]
C2  22uF  [CAPAE530X540N]
C3  100nF  [CAPC2012X135N]
C4  1uF  [CAPC2012X135N]
C5  100nF  [CAPC2012X135N]
C6  1nF  [CAPC2012X135N]
C10  100nF  [CAPC2012X135N]
C11  100nF  [CAPC2012X135N]
C?#1  10nF  [CAPC3216X100N]
C?#2  220nF  [CAPR500-350X720X850]
C?#3  220nF  [CAPR500-350X720X850]
C?#4  10nF  [CAPC3216X100N]
C?#5  220nF  [CAPR500-350X720X850]
C?#6  10nF  [CAPC3216X100N]
C?#7  220nF  [CAPR500-350X720X850]
C?#8  100nF  [CAPC2012X135N]
C?#9  10nF  [CAPC3216X100N]
C?#10  100nF  [CAPC2012X135N]
D1  STPS1150 ST  [DIOM5027X244N]
D?#1  BZG03C20  [DIOM5326X230N]
IC?#2  OPA350UA  [SOIC127P600X175-8N]
L1  33uH  [IND_PANASONIC_ELL6RH]
L2  50R@100MHz  [IND_MURATA_BLM31PG]
L?  50R@100MHz  [IND_MURATA_BLM31PG]
LD1  Super Red  [LED_OSRAM_LSR976]  (value not drawn)
P1  10k  [TRIM_BOURNS_3266W]
P?  10k  [TRIM_BOURNS_3266W]
R4  1k  [RESC2012X60N]
R7  1M  [RESC2012X60N]
R8  499k  [RESC2012X60N]
R10  25k5  [RESC2012X60N]
R11  90k9  [RESC2012X60N]
R12  4k75  [RESC2012X60N]
R13  0R18  [RESC2012X70N]
R15  3  [RESC2012X60N]
R16  3  [RESC2012X60N]
R?#5  10k  [RESC2012X60N]
R?#6  10k  [RESC2012X60N]
R?#7  10k  [RESC2012X60N]
R?#8  25k5  [RESC2012X60N]
R?#9  300k  [RESC2012X60N]
R?#10  1k  [RESC2012X60N]
R?#11  10k  [RESC2012X60N]
R?#12  10k  [RESC2012X60N]
R?#13  4k75  [RESC2012X60N]
R?#14  10k  [RESC2012X60N]
R?#15  10k  [RESC2012X60N]
SW1  Switch  [SW_TYCO_1-1437575-4]  (value not drawn)
SW2  Switch  [SW_TYCO_1-1437575-4]  (value not drawn)
T1  IRLML2803PBF  [SOT95P237X112-3N]
T2  SI3440DV Vishay  [SOT95P280X110-6N]
T4  BSP220 Phillips  [SOT230P700X175-4N]
T?#2  BF820  [SOT95P230X110-3N]

### Ports
HV_OUT (out), SD (in), VREF (in), VS (in), VSET (in)

### Nets
GND: =_Name_+_'_'_+_Manufacturer1.5(AGND) =_Name_+_'_'_+_Manufacturer1.7(PGND) C2.2 C3.1 C4.2 C6.1 C10.1 C11.1 C?#1.2 C?#2.1 C?#3.1 C?#4.1 C?#5.1 C?#6.1 C?#7.1 C?#9.1 C?#10.1 IC?#2.4(V-) P1.3(CW) R4.1 R12.1 R13.2 R?#7.1 R?#11.1 R?#12.1 R?#13.1 T1.2(S)
OUTC: SW2.3(NO) ; port VSET
Net=_Name_+_'_'_+_Manufacturer1_1: =_Name_+_'_'_+_Manufacturer1.1(ISEN) R13.1 T2.4(S)
Net=_Name_+_'_'_+_Manufacturer1_2: =_Name_+_'_'_+_Manufacturer1.2(UVLO) R10.1 R?#7.2
Net=_Name_+_'_'_+_Manufacturer1_3: =_Name_+_'_'_+_Manufacturer1.3(COMP) C5.2 C6.2
Net=_Name_+_'_'_+_Manufacturer1_4: =_Name_+_'_'_+_Manufacturer1.4(FB) P?.1(CCW) P?.2(W) R7.2
Net=_Name_+_'_'_+_Manufacturer1_6: =_Name_+_'_'_+_Manufacturer1.6(SD) R11.2
Net=_Name_+_'_'_+_Manufacturer1_8: =_Name_+_'_'_+_Manufacturer1.8(DR) T2.3(G)
Net=_Name_+_'_'_+_Manufacturer1_9: =_Name_+_'_'_+_Manufacturer1.9(VCC) C4.1
Net=_Name_+_'_'_+_Manufacturer1_10: =_Name_+_'_'_+_Manufacturer1.10(VIN) C2.1 C3.2 L1.1 R10.2 R15.1 R?#15.2 SW1.1(NC) ; port VS
NetC5_1: C5.1 R12.2
NetC10_2: C10.2 R15.2
NetC11_2: C11.2 IC?#2.3(IN+) R16.2
NetC?#1_1: C?#1.1 R?#5.2
NetC?#2_2: C?#2.2 C?#4.2 C?#5.2 D1.1(C) L?.1 R8.1
NetC?#3_2: C?#3.2 C?#6.2 C?#7.2 L2.2 R?#9.2 ; port HV_OUT
NetC?#8_1: C?#8.1 IC?#2.6(OUT) R?#10.2
NetC?#8_2: C?#8.2 C?#10.2 IC?#2.2(IN-) R?#9.1 R?#11.2
NetC?#9_2: C?#9.2 D?#1.1(C) L?.2 R?#6.2 T4.3(S)
NetD1_2: D1.2(A) L1.2 R?#5.1 T2.1(D) T2.2(D) T2.5(D) T2.6(D)
NetD?#1_2: D?#1.2(A) R?#6.1 R?#8.2 T4.1(G)
NetIC8_61: LD1.2(A) R?#14.1 T1.1(G) ; port SD
NetL2_1: L2.1 T4.2(D) T4.4(D)
NetL6_2: P1.1(CCW) ; port VREF
NetLD1_1: LD1.1(C) R4.2
NetP1_2: P1.2(W) SW2.1(NC)
NetP?_3: P?.3(CW) R?#12.2
NetR7_1: R7.1 R8.2
NetR11_1: R11.1 R?#15.1 T1.3(D)
NetR16_1: R16.1 SW2.2(C)
NetR?#8_1: R?#8.1 T?#2.3(C)
NetR?#10_1: R?#10.1 T?#2.1(B)
NetR?#13_2: R?#13.2 T?#2.2(E)
NetR?#14_2: R?#14.2 SW1.2(C)

Not connected (* = marked no-connect by the designer): IC?#2 7(V+); SW1 3(NO)

### Notes on the sheet
- (near T1) 1 = OP, 0 = SD
- (in symbol CAE530-540_22UF_16V_20%) +
- (in symbol LED_OSRAM_LSR976) Red
- (in symbol R0805_0R18_5%_0.25W_250PPM_PANASONIC_ERJ) 5%
- (in symbol R0805_1K_1%_0.33W_100PPM_VISHAY_CRCW-HP) 1%
- (in symbol R0805_1M_0.1%_0.1W_25PPM) 0.1%
- (in symbol R0805_3R_1%_0.125W_200PPM) 1%
- (in symbol R0805_4K75_0.1%_0.1W_10PPM) 0.1%
- (in symbol R0805_10K_1%_0.125W_100PPM) 1%
- (in symbol R0805_25K5_0.1%_0.1W_10PPM) 0.1%
- (in symbol R0805_90K9_0.1%_0.1W_10PPM) 0.1%
- (in symbol R0805_300K_1%_0.125W_100PPM) 1%
- (in symbol R0805_499K_0.1%_0.25W_25PPM_150V) 0.1%

### Library data of the parts
=_Name_+_'_'_+_Manufacturer1 = LM3418: Manufacutrer: TI; Name: LM3418
C2 = CAE530-540_22UF_16V_20%: Polarised capacitor; Part Description: Aluminum Electrolytic SMT Capacitor; Manufacturer: PANASONIC; Manufacturer Part Number: EEEFK1C220AR; Voltage: 16V; Tolerance: ±20%; Part Number: CAE530-540_22UF_16V_20%; Component Kind: Standard; Component Type: Standard; Pin Count: 2; Value: 22uF; Status: Not Recommended; Case: B; Mounted: Yes; Socket: No; SMD: Yes; Sense: No; ComponentHeight: 5.8mm; HelpURL: \\cern.ch\dfs\Applications\Altium\Datasheets\CAE_PANASONIC_FK.pdf; Author: CERN DEM JLC; CreateDate: 03.12.2007; LatestRevisionDate: 05.11.2014
C3 C5 C10 C11 C?#8 C?#10 = CC0805_100NF_50V_10%_X7R: as C31 on sheet Pulser; Part Number: CC0805_100NF_50V_10%_X7R; Component Kind: Standard; Component Type: Standard; Pin Count: 2; Value: 100nF; Status: Preferred; Manufacturer Part Number: CC0805_100NF_50V_10%_X7R; Case: 0805; Mounted: Yes; Socket: No; SMD: Yes; Sense: No; Manufacturer1 Example: TDK; Manufacturer1 ComponentHeight: 1mm; HelpURL: \\cern.ch\dfs\Applications\Altium\Datasheets\CC0805_X7R_TDK_C.pdf; Author: CERN DEM JLC; CreateDate: 03.12.2007; LatestRevisionDate: 22.04.2015
C4 = CC0805_1UF_16V_10%_X7R: Non-polarised capacitor; Part Description: SMD Multilayer Chip Ceramic Capacitor; Manufacturer: GENERIC; Manufacturer1 Part Number: C2012X7R1C105K125AA; Voltage: 16V; TC: X7R; Tolerance: ±10%; Part Number: CC0805_1UF_16V_10%_X7R; Component Kind: Standard; Component Type: Standard; Pin Count: 2; Value: 1uF; Status: Preferred; Manufacturer Part Number: CC0805_1UF_16V_10%_X7R; Case: 0805; Mounted: Yes; Socket: No; SMD: Yes; Sense: No; Manufacturer1 Example: TDK; Manufacturer1 ComponentHeight: 1.45mm; HelpURL: \\cern.ch\dfs\Applications\Altium\Datasheets\CC0805_X7R_TDK_C.pdf; Author: CERN DEM JLC; CreateDate: 03.12.2007; LatestRevisionDate: 22.04.2015
C6 = CC0805_1NF_50V_10%_X7R: Non-polarised capacitor; Part Description: SMD Multilayer Chip Ceramic Capacitor; Manufacturer: GENERIC; Manufacturer1 Part Number: 223858015623; Voltage: 50V; TC: X7R; Tolerance: ±10%; Part Number: CC0805_1NF_50V_10%_X7R; Component Kind: Standard; Component Type: Standard; Pin Count: 2; Value: 1nF; Status: Preferred; Manufacturer Part Number: CC0805_1NF_50V_10%_X7R; Case: 0805; Mounted: Yes; Socket: No; SMD: Yes; Sense: No; Manufacturer1 Example: PHYCOMP; Manufacturer1 ComponentHeight: 1.35mm; HelpURL: \\cern.ch\dfs\Applications\Altium\Datasheets\CC0805_X7R_PHYCOMP.pdf; Author: CERN DEM JLC; CreateDate: 03.12.2007; LatestRevisionDate: 22.04.2015
C?#1 C?#4 C?#6 C?#9 = CC1206_10NF_200V_5%_C0G: Non-polarised capacitor; Part Description: SMD Multilayer Chip Ceramic Capacitor; Manufacturer: GENERIC; Manufacturer1 Part Number: C1206C103J2GACAUTO; Voltage: 200V; TC: C0G/NP0; Tolerance: ±5%; Part Number: CC1206_10NF_200V_5%_C0G; Component Kind: Standard; Component Type: Standard; Pin Count: 2; Value: 10nF; Status: Preferred; Manufacturer Part Number: CC1206_10NF_200V_5%_C0G; Case: 1206; Mounted: Yes; Socket: No; SMD: Yes; Sense: No; Manufacturer1 Example: KEMET; Manufacturer1 ComponentHeight: 1.0mm; HelpURL: \\cern.ch\dfs\Applications\Altium\Datasheets\CC1206_C0G_KEMET.pdf; Author: CERN DEM JLC; CreateDate: 25.11.2014; LatestRevisionDate: 25.11.2014
C?#2 C?#3 C?#5 C?#7 = CPER_220NF_100V_10%_500-350X720X850: Non-polarised capacitor; Part Description: Metallized Polyester Film Capacitor (MKS2); Manufacturer: WIMA; Manufacturer Part Number: MKS2D032201C00KSSD; Voltage: 100VDC/63VAC; Tolerance: ±10%; Part Number: CPER_220NF_100V_10%_500-350X720X850; Component Kind: Standard; Component Type: Standard; Pin Count: 2; Value: 220nF; Status: None; Case: LS5 W3.5 x L7.2 x H8.5; Mounted: Yes; Socket: No; SMD: No; Sense: No; ComponentHeight: 8.5mm; HelpURL: \\cern.ch\dfs\Applications\Altium\Datasheets\CPER_WIMA_MKS2.pdf; Author: CERN DEM JLC; CreateDate: 22.03.2010; LatestRevisionDate: 30.01.2012
D1 = STPS1150: Diode Schottky  Anode Pin 1 Cathode Pin 3 (Pas de pin 2); Name: STPS1150; Manufacturer: ST
D?#1 = BZG03C20: Zener Diode; Part Description: Voltage Regulator Diode; Manufacturer: VISHAY SEMICONDUCTOR; Voltage: 20V; Power: 1.25W; PressFit: No; Bonding: No; Part Number: BZG03C20; Component Kind: Standard; Component Type: Standard; Device: BZG03C20; PackageDescription: DO-214-AC/SMA Molded Diode, Body 5.3x2.6mm, IPC Medium Density; Manufacturer Part Number: BZG03C20; Pin Count: 2; Case: DO-214AC; Mounted: Yes; Socket: No; SMD: Yes; Sense: No; ComponentHeight: 2.3mm; HelpURL: \\cern.ch\dfs\Applications\Altium\Datasheets\BZG03C.pdf; Author: CERN DEM JLC; CreateDate: 02.06.2008; LatestRevisionDate: 02.06.2008
IC?#2 = OPA350UA: Operational Amplifier; Part Description: High-Speed, Single-Supply, Rail-to-Rail Operational Amplifier; Manufacturer: TEXAS INSTRUMENTS; PressFit: No; Bonding: No; Part Number: OPA350UA; Component Kind: Standard; Component Type: Standard; Device: OPA350UA; PackageDescription: SOIC 8, Pitch 1.27mm - Body 4x5mm, IPC Medium Density; Manufacturer Part Number: OPA350UA; Pin Count: 5; Case: SOIC8; Mounted: Yes; Socket: No; SMD: Yes; Sense: No; ComponentHeight: 1.75mm; Author: CERN DEM JLC; HelpURL: \\cern.ch\dfs\Applications\Altium\Datasheets\OPA350UA.pdf; CreateDate: 11.10.2012; LatestRevisionDate: 11.10.2012
L1 = IND_33UH_20%_PANASONIC_ELL6RH330M: Inductor With Magnetic core 1Dot; Part Description: SMD Choke Coil; Power: 600mA; Resistance: 0.38R; Tolerance: ±20%; Part Number: IND_33UH_20%_PANASONIC_ELL6RH330M; Component Kind: Standard; Component Type: Standard; Pin Count: 2; Value: 33uH; Status: None; Manufacturer: PANASONIC; Manufacturer Part Number: ELL6RH330M; Mounted: Yes; Socket: No; SMD: Yes; Sense: No; ComponentHeight: 2.8mm; HelpURL: \\cern.ch\dfs\Applications\Altium\Datasheets\IND_PANASONIC_ELL6RH.pdf; Author: CERN DEM JMW; CreateDate: 09.01.2009; LatestRevisionDate: 09.01.2009
L2 L? = IND1206_MURATA_BLM31PG500SN1: Inductor; Part Description: SMD EMIFIL Chip Ferrite Bead; Manufacturer: MURATA; Power: 3.5A; Resistance: 0.015R; Part Number: IND1206_MURATA_BLM31PG500SN1; Component Kind: Standard; Component Type: Standard; Pin Count: 2; Value: 50R@100MHz; Status: None; Manufacturer Part Number: BLM31PG500SN1; Case: 1206; Mounted: Yes; Socket: No; SMD: Yes; Sense: No; ComponentHeight: 1.3mm; HelpURL: \\cern.ch\dfs\Applications\Altium\Datasheets\IND1206_MURATA_BLM31P.pdf; Author: CERN DEM JLC; CreateDate: 05.12.2013; LatestRevisionDate: 05.12.2013
LD1 = LED_OSRAM_LSR976: as LD2 on sheet Pulser; Part Number: LED_OSRAM_LSR976; Component Kind: Standard; Component Type: Standard; Color: Super Red; PackageDescription: Super Red Chip LED, 2-Leads, Body 2 x1.25mm, IPC Medium Density; Pin Count: 2; Case: 0805; Mounted: Yes; Socket: No; SMD: Yes; Sense: No; ComponentHeight: 0.9mm; HelpURL: \\cern.ch\dfs\Applications\Altium\Datasheets\LED_OSRAM_LSR976.pdf; Author: CERN DEM JLC; CreateDate: 18.05.2010; LatestRevisionDate: 18.05.2010
P1 P? = TRIM_12T_10K_BOURNS_3266W-1-103LF: as P5 on sheet Main; Part Number: TRIM_12T_10K_BOURNS_3266W-1-103LF; Component Kind: Standard; Component Type: Standard; Pin Count: 3; Value: 10k; Manufacturer Part Number: 3266W-1-103LF; Case: 3266W; Mounted: Yes; Socket: No; SMD: No; Sense: No; ComponentHeight: 7.75mm; HelpURL: \\cern.ch\dfs\Applications\Altium\Datasheets\TRIM_BOURNS_3266W.pdf; Author: CERN DEM JLC; CreateDate: 10.06.2008; LatestRevisionDate: 28.11.2012
R4 R?#10 = R0805_1K_1%_0.33W_100PPM_VISHAY_CRCW-HP: as R?#2 on sheet Pulser; Part Number: R0805_1K_1%_0.33W_100PPM_VISHAY_CRCW-HP; Component Kind: Standard; Component Type: Standard; Pin Count: 2; Value: 1k; Status: None; Tolerance: ±1%; Case: 0805; Mounted: Yes; Sense: No; Socket: No; SMD: Yes; Manufacturer1 ComponentHeight: 0.6mm; HelpURL: \\cern.ch\dfs\Applications\Altium\Datasheets\R0805_VISHAY_CRCW-HP e3.pdf; Author: CERN DEM JLC; CreateDate: 16.06.2010; LatestRevisionDate: 16.06.2010
R7 = R0805_1M_0.1%_0.1W_25PPM: Resistor - 0.1%; Part Description: Precision Surface Mount Resistor; Manufacturer: GENERIC; Manufacturer1 Part Number: PCF0805R-1M0BT1; Power: 0.1W; TC: ±25ppm/°C; PressFit: No; Part Number: R0805_1M_0.1%_0.1W_25PPM; Component Kind: Standard; Component Type: Standard; Pin Count: 2; Value: 1M; Status: Not Recommended; Tolerance: ±0.1%; Manufacturer Part Number: R0805_1M_0.1%_0.1W_25PPM; Case: 0805; Mounted: Yes; Sense: No; Socket: No; SMD: Yes; Manufacturer1 Example: WELWYN COMPONENTS; HelpURL: \\cern.ch\dfs\Applications\Altium\Datasheets\R0805_WELWYN_PCF0805R.pdf; Author: CERN DEM JLC; CreateDate: 17.11.2008; LatestRevisionDate: 26.04.2010
R8 = R0805_499K_0.1%_0.25W_25PPM_150V: Resistor - 0.1%; Part Description: Thin Film Chip Resistor; Manufacturer: GENERIC; Manufacturer1 Part Number: RP73PF2A499KBTDF; Power: 0.25W; TC: ±25ppm/°C; Voltage: 150V; PressFit: No; Part Number: R0805_499K_0.1%_0.25W_25PPM_150V; Component Kind: Standard; Component Type: Standard; Pin Count: 2; Value: 499k; Status: None; Tolerance: ±0.1%; Manufacturer Part Number: R0805_499K_0.1%_0.25W_25PPM_150V; Case: 0805; Mounted: Yes; Sense: No; Socket: No; SMD: Yes; Manufacturer1 Example: TYCO ELECTRONICS; Manufacturer1 ComponentHeight: 0.65mm; HelpURL: \\cern.ch\dfs\Applications\Altium\Datasheets\R0805_TYCO_RP73.pdf; Author: CERN DEM BC; CreateDate: 04.12.2015; LatestRevisionDate: 04.12.2015
R10 R?#8 = R0805_25K5_0.1%_0.1W_10PPM: Resistor - 0.1%; Part Description: Thin Film Chip Resistor; Manufacturer: GENERIC; Manufacturer1 Part Number: RN73C2A25K5BTG; Power: 0.1W; TC: ±10ppm; PressFit: No; Part Number: R0805_25K5_0.1%_0.1W_10PPM; Component Kind: Standard; Component Type: Standard; Pin Count: 2; Value: 25k5; Status: Not Recommended; Tolerance: ±0.1%; Manufacturer Part Number: R0805_25K5_0.1%_0.1W_10PPM; Case: 0805; Mounted: Yes; Sense: No; Socket: No; SMD: Yes; Manufacturer1 Example: TYCO HOLSWORTHY; Manufacturer1 ComponentHeight: 0.6mm; HelpURL: \\cern.ch\dfs\Applications\Altium\Datasheets\R0805_Tyco_RN73.pdf; Author: CERN DEM JLC; CreateDate: 03.12.2007; LatestRevisionDate: 13.03.2008
R11 = R0805_90K9_0.1%_0.1W_10PPM: Resistor - 0.1%; Part Description: Thin Film Chip Resistor; Manufacturer: GENERIC; Manufacturer1 Part Number: RN73C2A90K9BTG; Power: 0.1W; TC: ±10ppm; PressFit: No; Part Number: R0805_90K9_0.1%_0.1W_10PPM; Component Kind: Standard; Component Type: Standard; Pin Count: 2; Value: 90k9; Status: Not Recommended; Tolerance: ±0.1%; Manufacturer Part Number: R0805_90K9_0.1%_0.1W_10PPM; Case: 0805; Mounted: Yes; Sense: No; Socket: No; SMD: Yes; Manufacturer1 Example: TYCO HOLSWORTHY; Manufacturer1 ComponentHeight: 0.6mm; HelpURL: \\cern.ch\dfs\Applications\Altium\Datasheets\R0805_Tyco_RN73.pdf; Author: CERN DEM JLC; CreateDate: 03.12.2007; LatestRevisionDate: 13.03.2008
R12 R?#13 = R0805_4K75_0.1%_0.1W_10PPM: Resistor - 0.1%; Part Description: Thin Film Chip Resistor; Manufacturer: GENERIC; Manufacturer1 Part Number: RN73C2A4K75BTG; Power: 0.1W; TC: ±10ppm; PressFit: No; Part Number: R0805_4K75_0.1%_0.1W_10PPM; Component Kind: Standard; Component Type: Standard; Pin Count: 2; Value: 4k75; Status: Not Recommended; Tolerance: ±0.1%; Manufacturer Part Number: R0805_4K75_0.1%_0.1W_10PPM; Case: 0805; Mounted: Yes; Sense: No; Socket: No; SMD: Yes; Manufacturer1 Example: TYCO HOLSWORTHY; Manufacturer1 ComponentHeight: 0.6mm; HelpURL: \\cern.ch\dfs\Applications\Altium\Datasheets\R0805_Tyco_RN73.pdf; Author: CERN DEM JLC; CreateDate: 03.12.2007; LatestRevisionDate: 13.03.2008
R13 = R0805_0R18_5%_0.25W_250PPM_PANASONIC_ERJ: Resistor - 5%; Part Description: Low Resistance Thick Film Chip Resistor; Manufacturer Part Number: ERJ6BSJR18V; Power: 0.25W; TC: ±250ppm/°C; PressFit: No; Part Number: R0805_0R18_5%_0.25W_250PPM_PANASONIC_ERJ; Component Kind: Standard; Component Type: Standard; Pin Count: 2; Value: 0R18; Status: Not Recommended; Tolerance: ±5%; Manufacturer: PANASONIC; Case: 0805; Mounted: Yes; Sense: No; Socket: No; SMD: Yes; ComponentHeight: 0.7mm; HelpURL: \\cern.ch\dfs\Applications\Altium\Datasheets\R0805_PANASONIC_ERJ.pdf; Author: CERN DEM JLC; CreateDate: 22.06.2011; LatestRevisionDate: 22.06.2011
R15 R16 = R0805_3R_1%_0.125W_200PPM: Resistor - 1%; Part Description: General Purpose Thick Film Chip Resistor; Manufacturer: GENERIC; Manufacturer1 Part Number: 232273463008L or RC0805FR-073RL; Power: 0.125W; TC: ±200ppm/°C; PressFit: No; Part Number: R0805_3R_1%_0.125W_200PPM; Component Kind: Standard; Component Type: Standard; Pin Count: 2; Value: 3; Status: Preferred; Tolerance: ±1%; Manufacturer Part Number: R0805_3R_1%_0.125W_200PPM; Case: 0805; Mounted: Yes; Sense: No; Socket: No; SMD: Yes; Manufacturer1 Example: YAGEO PHYCOMP; Manufacturer1 ComponentHeight: 0.65mm; HelpURL: \\cern.ch\dfs\Applications\Altium\Datasheets\R0805_Phycomp_RC0805.pdf; Author: CERN DEM JLC; CreateDate: 03.12.2007; LatestRevisionDate: 17.10.2012
R?#5-R?#7 R?#11 R?#12 R?#14 R?#15 = R0805_10K_1%_0.125W_100PPM: as R?#1 on sheet Pulser; Part Number: R0805_10K_1%_0.125W_100PPM; Component Kind: Standard; Component Type: Standard; Pin Count: 2; Value: 10k; Status: Preferred; Tolerance: ±1%; Manufacturer Part Number: R0805_10K_1%_0.125W_100PPM; Case: 0805; Mounted: Yes; Sense: No; Socket: No; SMD: Yes; Manufacturer1 Example: NIC COMPONENT; Manufacturer1 ComponentHeight: 0.6mm; HelpURL: \\cern.ch\dfs\Applications\Altium\Datasheets\R0805_NIC_NRC.pdf; Author: CERN DEM JLC; CreateDate: 03.12.2007; LatestRevisionDate: 13.03.2008
R?#9 = R0805_300K_1%_0.125W_100PPM: as R?#4 on sheet Pulser; Part Number: R0805_300K_1%_0.125W_100PPM; Component Kind: Standard; Component Type: Standard; Pin Count: 2; Value: 300k; Status: Preferred; Tolerance: ±1%; Manufacturer Part Number: R0805_300K_1%_0.125W_100PPM; Case: 0805; Mounted: Yes; Sense: No; Socket: No; SMD: Yes; Manufacturer1 Example: NIC COMPONENT; Manufacturer1 ComponentHeight: 0.6mm; HelpURL: \\cern.ch\dfs\Applications\Altium\Datasheets\R0805_NIC_NRC.pdf; Author: CERN DEM JLC; CreateDate: 03.12.2007; LatestRevisionDate: 13.03.2008
SW1 SW2 = SW_TYCO_1-1437575-4: as SW6 on sheet Main; Part Number: SW_TYCO_1-1437575-4; Component Kind: Standard; Component Type: Standard; Pin Count: 3; PackageDescription: Body 8.79 x 3.4mm, Slide Low Profile SPDT Switch, SSA Series; Family: Switch; Mounted: Yes; Socket: No; SMD: No; Sense: No; Status: None; ComponentHeight: 5.4mm; HelpURL: \\cern.ch\dfs\Applications\Altium\Datasheets\SW_TYCO_1-1437575-4.pdf; Author: CERN DEM JLC; CreateDate: 11.11.2013; LatestRevisionDate: 11.11.2013
T1 = IRLML2803PBF: N-CHANNEL MOSFET WITH ZENER DIODE; Part Description: 30V 1.2A  N-Channel HEXFET® Power MOSFET; Manufacturer: INTERNATIONAL RECTIFIER; PressFit: No; Bonding: No; Part Number: IRLML2803PBF; Component Kind: Standard; Component Type: Standard; Device: IRLML2803PBF; PackageDescription: SOT, 0.95mm, pitch; 3 pin,1.30mm W X 2.92mm L X 1.12mm H body, IPC Medium Density; Manufacturer Part Number: IRLML2803PBF; Pin Count: 3; Case: SOT23-3; Mounted: Yes; Socket: No; SMD: Yes; Sense: No; ComponentHeight: 1.12mm; HelpURL: \\cern.ch\dfs\Applications\Altium\Datasheets\IRLML2803PBF.pdf; Author: CERN DEM JMW; CreateDate: 08.12.2010; LatestRevisionDate: 08.12.2010
T2 = SI3440DV: N-Channel MOSFET; Name: SI3440DV; Manufacturer: Vishay
T4 = BSP220: P-Channel MOSFET; Name: BSP220; Manufacturer: Phillips
T?#2 = BF820: as T?#1 on sheet Pulser; Part Number: BF820; Component Kind: Standard; Component Type: Standard; Device: BF820; PackageDescription: SOT23, 3 pin, Pitch 0.95mm - 1.3mm W X 2.9mm L X 1.1mm H, IPC Medium Density; Manufacturer Part Number: BF820; Pin Count: 3; Case: SOT23-3; Mounted: Yes; Socket: No; SMD: Yes; Sense: No; ComponentHeight: 1.1mm; HelpURL: \\cern.ch\dfs\Applications\Altium\Datasheets\BF820.pdf; Author: CERN DEM JLC; CreateDate: 23.09.2014; LatestRevisionDate: 23.09.2014